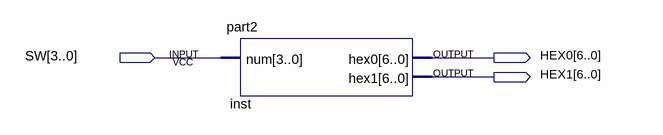
[diagram p0: schematic sheet]
// Quartus schematic part2_diagram.bdf as structural Verilog: 1 symbols, 3 pins
module part2_diagram (
  input  [3:0] SW,
  output [6:0] HEX0,
  output [6:0] HEX1
);

  part2 inst (.num(SW), .hex0(HEX0), .hex1(HEX1));
endmodule
